# Altium schematic sheet USB.SchDoc
size A
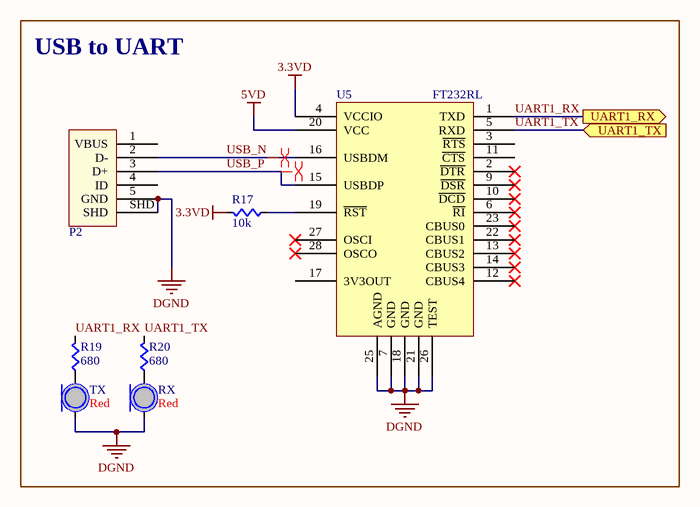
[diagram p0: USB.SchDoc]

## Parts
P2  USB Micro  [10118192-0001LF]  (value not drawn)
R17  value 10k  [RES0603]  (hidden comment: Res)
R19  value 680  [RES0603]  (hidden comment: Res)
R20  value 680  [RES0603]  (hidden comment: Res)
RX  Color: Red  [LED0603]  (hidden comment: LED)
TX  Color: Red  [LED0603]  (hidden comment: LED)
U5  FT232RL  [SSOP_28_N]

## Blocks framed on the sheet
USB to UART: P2 R17 R19 R20 RX TX U5

## Ports
UART1_RX (out), UART1_TX (in)

## Nets
3.3VD: R17.1(A) U5.4(VCCIO)
5VD: U5.20(VCC)
DGND: P2.5(GND) P2.SHD RX.C TX.C U5.7(GND) U5.18(GND) U5.21(GND) U5.25(AGND) U5.26(TEST)
UART1_RX: R19.1(A) U5.1(TXD) ; port UART1_RX
UART1_TX: R20.1(A) U5.5(RXD) ; port UART1_TX
USB_N: P2.2(D-) U5.16(USBDM)
USB_P: P2.3(D+) U5.15(USBDP)
NetR17_2: R17.2(B) U5.19(~{RST})
NetR19_2: R19.2(B) TX.A
NetR20_2: R20.2(B) RX.A

Not connected (* = marked no-connect by the designer): P2 1(VBUS) 4(ID); U5 2(~{DTR})* 3(~{RTS}) 6(~{RI})* 9(~{DSR})* 10(~{DCD})* 11(~{CTS}) 12(CBUS4)* 13(CBUS2)* 14(CBUS3)* 17(3V3OUT) 22(CBUS1)* 23(CBUS0)* 27(OSCI)* 28(OSCO)*

## Layout directives
differential pair: USB_N, USB_P

## Library data of the parts
P2 = USB Micro: USB Mini B Metal Shield SMT; Supplier 1: Digi-Key; Supplier Part Number 1: 609-4613-1-ND
U5 = FT232RL: IC USB FS SERIAL UART 28-SSOP; Supplier Part Number 1: 768-1007-1-ND; Supplier 1: Digi-Key
R17 R19 R20 = Res: Supplier 1: Digi-Key; Supplier Part Number 1: RMCF0603JT10K0CT-ND
RX TX = LED: Supplier 1: Digi-Key; Supplier Part Number 1: 754-1122-1-ND